# EAGLE design spi_v3 (EAGLE 7.3.0)
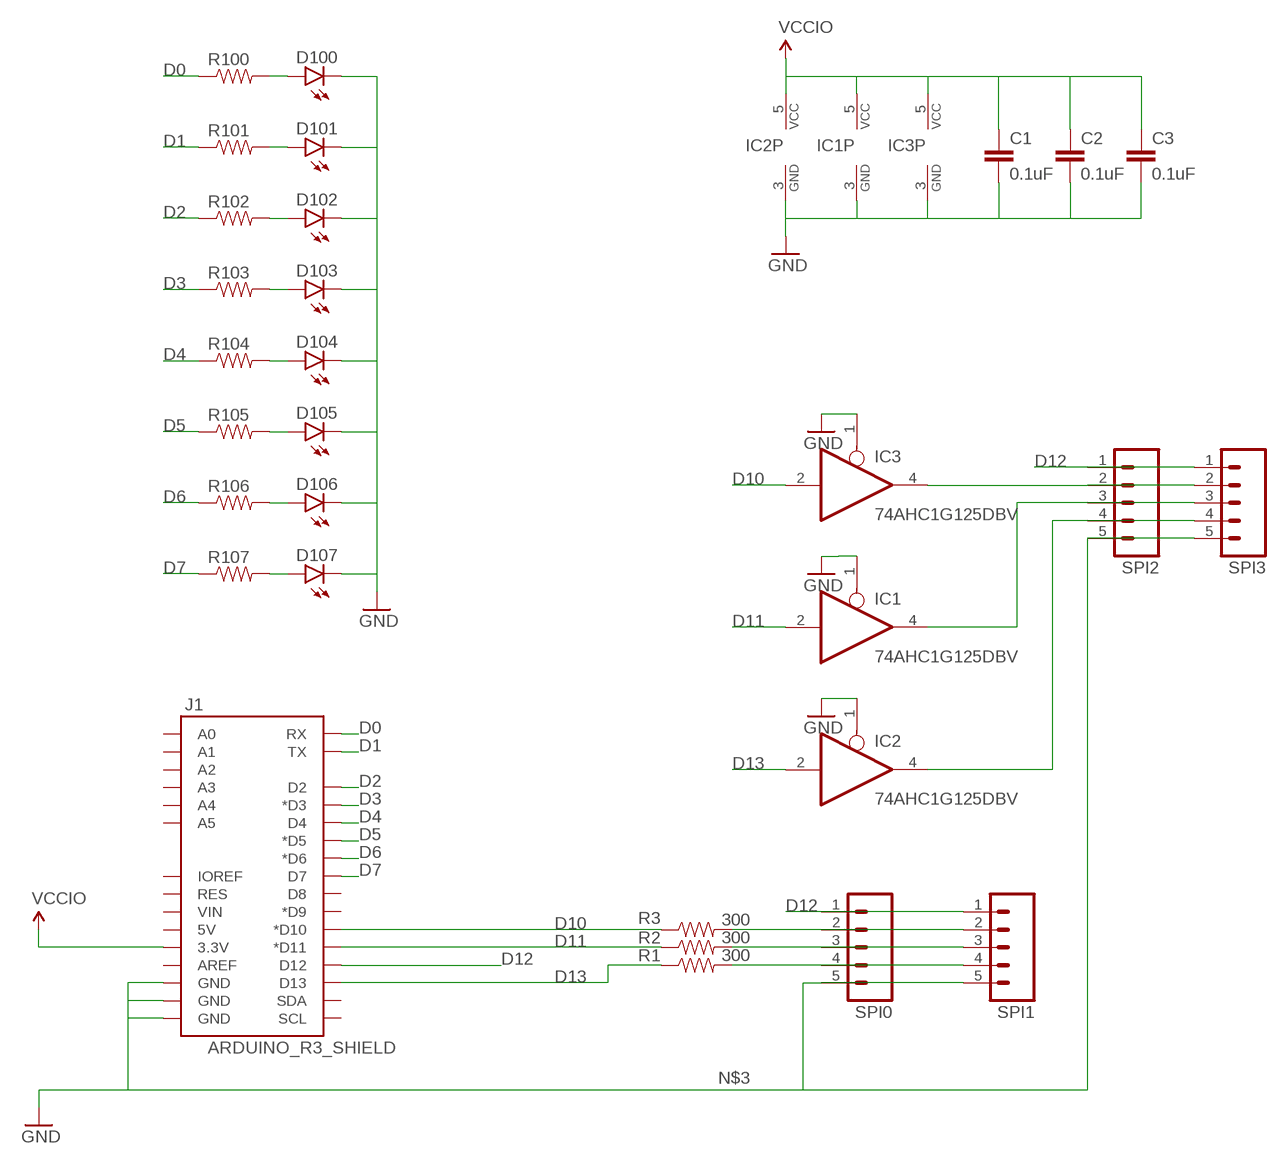
[diagram p0: schematic, sheet 1]

## Parts
C1  0.1uF  0.1UF-16V(+-10%)(0402)  [0402-CAP]
C2  0.1uF  0.1UF-16V(+-10%)(0402)  [0402-CAP]
C3  0.1uF  0.1UF-16V(+-10%)(0402)  [0402-CAP]
D100  LED-FKIT-1206  [FKIT-LED-1206]
D101  LED-FKIT-1206  [FKIT-LED-1206]
D102  LED-FKIT-1206  [FKIT-LED-1206]
D103  LED-FKIT-1206  [FKIT-LED-1206]
D104  LED-FKIT-1206  [FKIT-LED-1206]
D105  LED-FKIT-1206  [FKIT-LED-1206]
D106  LED-FKIT-1206  [FKIT-LED-1206]
D107  LED-FKIT-1206  [FKIT-LED-1206]
IC1  74AHC1G125DBV  [SOT23-5]
IC2  74AHC1G125DBV  [SOT23-5]
IC3  74AHC1G125DBV  [SOT23-5]
J1  ARDUINO_R3_SHIELD  [UNO_R3_SHIELD]
R1  300  RESISTORPTH-1/4W  [AXIAL-0.4]
R2  300  RESISTORPTH-1/4W  [AXIAL-0.4]
R3  300  RESISTORPTH-1/4W  [AXIAL-0.4]
R100  RESISTOR0805-RES  [0805]
R101  RESISTOR0805-RES  [0805]
R102  RESISTOR0805-RES  [0805]
R103  RESISTOR0805-RES  [0805]
R104  RESISTOR0805-RES  [0805]
R105  RESISTOR0805-RES  [0805]
R106  RESISTOR0805-RES  [0805]
R107  RESISTOR0805-RES  [0805]
SPI0  M05PTH_LONGPADS  [1X05_LONGPADS]
SPI1  M05PTH_LONGPADS  [1X05_LONGPADS]
SPI2  M05PTH_LONGPADS  [1X05_LONGPADS]
SPI3  M05PTH_LONGPADS  [1X05_LONGPADS]

## Nets
D0: J1.RX R100.1
D1: J1.TX R101.1
D2: J1.D2 R102.1
D3: J1.D3(*D3) R103.1
D4: J1.D4 R104.1
D5: J1.D5(*D5) R105.1
D6: J1.D6(*D6) R106.1
D7: J1.D7 R107.1
D10: IC3.2(I) J1.D10(*D10) R3.P$1
D11: IC1.2(I) J1.D11(*D11) R2.P$1
D12: J1.D12 SPI0.1 SPI1.1 SPI2.1 SPI3.1
D13: IC2.2(I) J1.D13 R1.P$1
N$1: D107.A R107.2
N$3: C1.2 C2.2 C3.2 D100.C D101.C D102.C D103.C D104.C D105.C D106.C D107.C IC1.1(OE) IC1.3(GND) IC2.1(OE) IC2.3(GND) IC3.1(OE) IC3.3(GND) J1.GND@0(GND) J1.GND@1(GND) J1.GND@2(GND) SPI0.5 SPI1.5 SPI2.5 SPI3.5 ; supply symbol labelled GND
N$4: R1.P$2 SPI0.4 SPI1.4
N$5: R2.P$2 SPI0.3 SPI1.3
N$6: R3.P$2 SPI0.2 SPI1.2
N$8: D106.A R106.2
N$9: D105.A R105.2
N$10: D104.A R104.2
N$11: D103.A R103.2
N$12: D102.A R102.2
N$13: D100.A R100.2
N$14: D101.A R101.2
N$24: IC3.4(O) SPI2.2 SPI3.2
N$25: IC1.4(O) SPI2.3 SPI3.3
N$26: IC2.4(O) SPI2.4 SPI3.4
VCCIO: C1.1 C2.1 C3.1 IC1.5(VCC) IC2.5(VCC) IC3.5(VCC) J1.3.3V
Unconnected: J1.5V J1.A0 J1.A1 J1.A2 J1.A3 J1.A4 J1.A5 J1.AREF J1.D8 J1.D9(*D9) J1.IOREF J1.RES J1.SCL J1.SDA J1.VIN

## Library data of the parts
C1-C3 = SparkFun-Capacitors:0.1UF-16V(+-10%)(0402); PROD_ID: CAP-12416
D100-D107 = SparkFun-LED:LED: LEDs Standard schematic elements and footprints for 5mm, 3mm, 1206, and 0603 sized LEDs. 5mm - Spark Fun Electronics SKU : COM-00529 (and others)
IC1-IC3 = 74xx-little-us:74*1G125: Single Bus Buffer Gate with 3-State Output
J1 = SparkFun-Boards:ARDUINO_R3_SHIELD: Shield form compatible with the Arduino Uno R3.
R1-R3 R100-R107 = SparkFun-Passives:RESISTOR: Resistor Basic schematic elements and footprints for 0603, 1206, and PTH resistors.
SPI0 SPI1-SPI3 = SparkFun-Connectors:M05: Header 5 Standard 5-pin 0.1" header. Use with straight break away headers (SKU : PRT-00116), right angle break away headers (PRT-00553), swiss pins (PRT-00743), machine pins (PRT-00117), and female headers (PRT-00115). Molex polarized connector foot print use with SKU : PRT-08230 with associated crimp pins and housings.

## Board
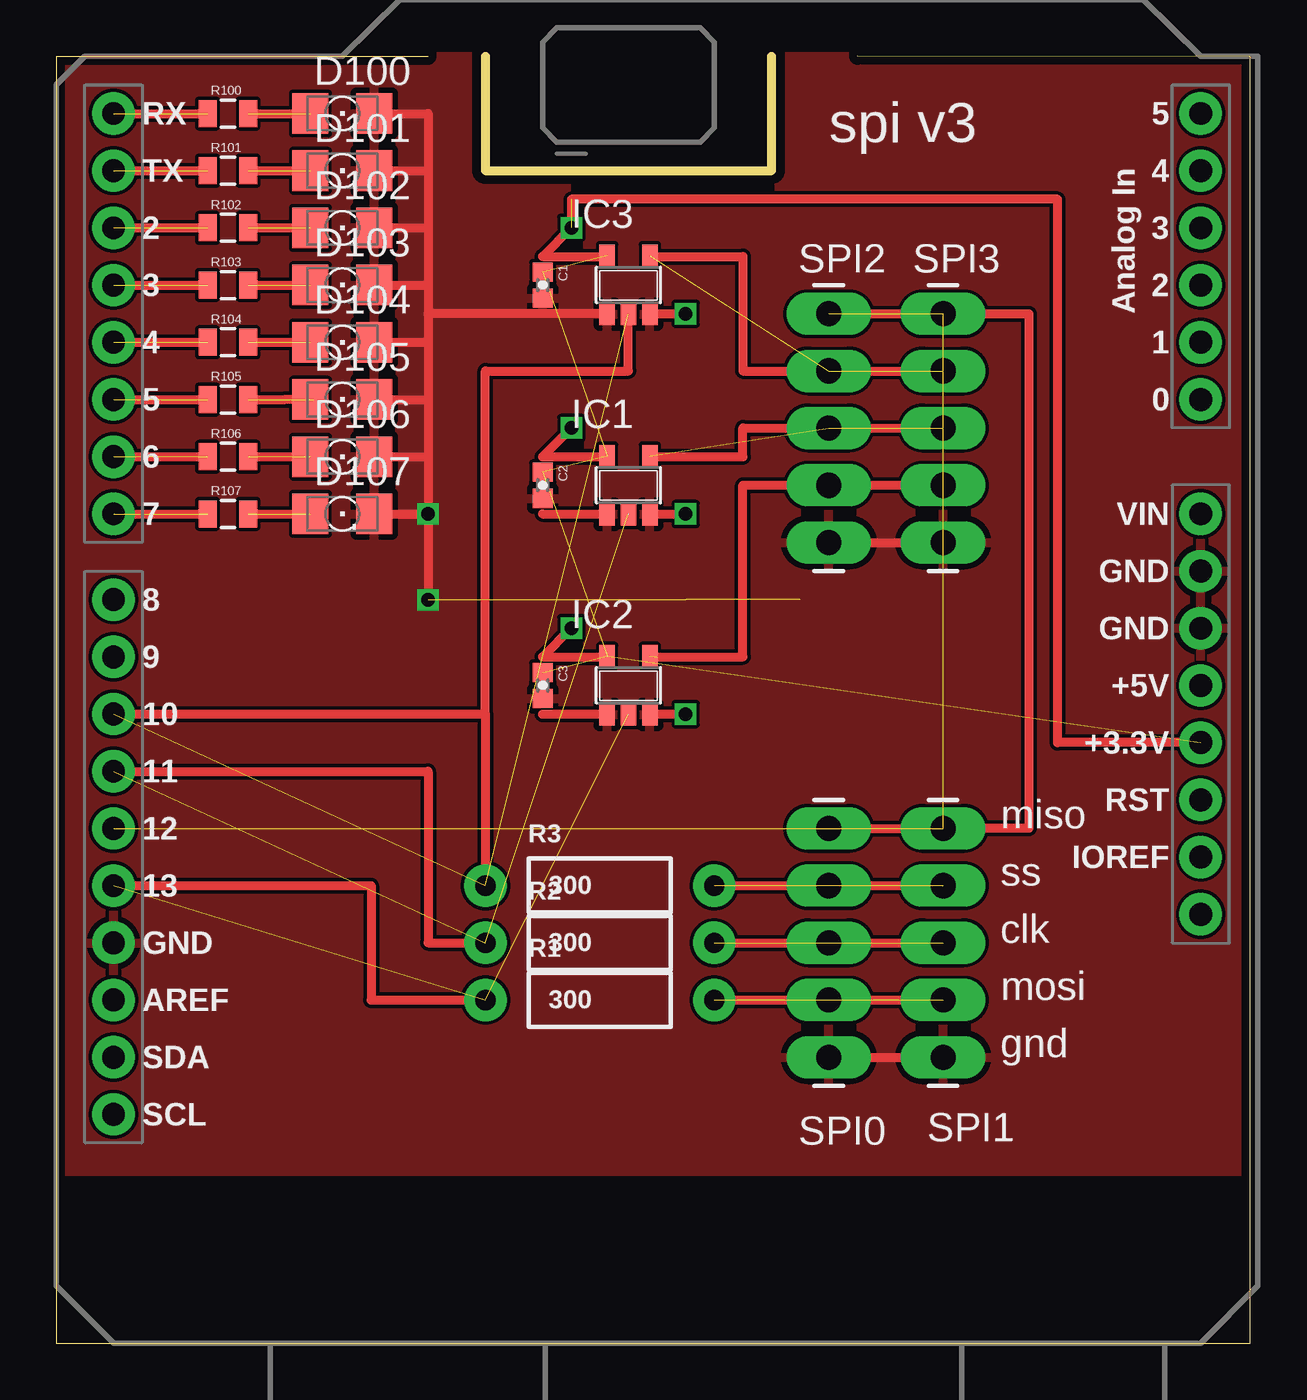
[diagram p1: board, top side]
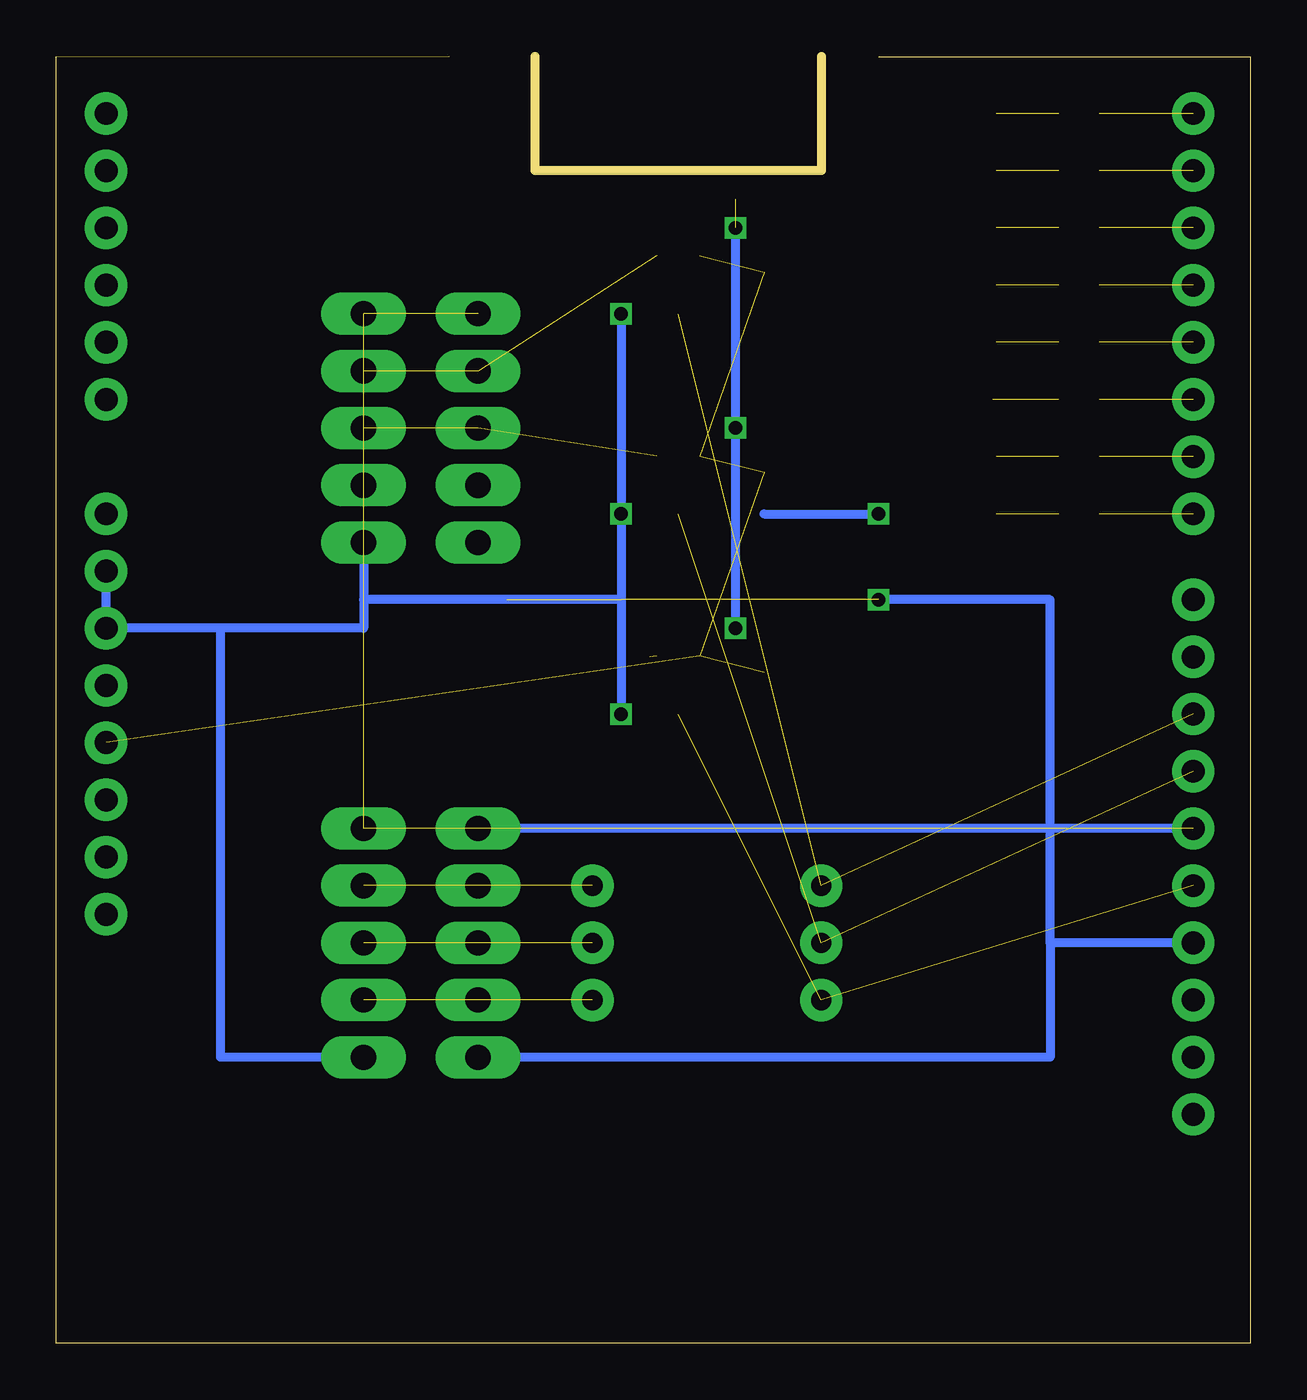
[diagram p2: board, bottom side, seen from below]

Size 53.01 x 57.15 mm. Coordinates in mm from the lower left corner, seen from the top.
Outline: 35.56,57.15 53.01,57.14 53.01,0 0,0 0,57.14 16.51,57.14
Outline: 19.05,57.15 19.05,52.07 31.75,52.07 31.75,57.15
Copper layers (1*16): Top 0.0356mm / dielectric 1.5011mm / Bottom 0.0356mm
Design rules "oshpark-2layer": minimum track width 6mil, minimum drill 13mil, track to track 6mil, track to pad 6mil, pad to pad 6mil, via to via 6mil, smd to smd 6mil, copper to edge 15mil, drill to drill 6mil, minimum pad ring 7mil, minimum via ring 7mil, stop-mask expansion 4mil, vias tented up to drill 0mil, thermal gap 10mil

### Footprints (pad centres in the part's own frame; a part is rotated, then mirrored left to right if it is on the bottom)
0402-CAP = smd 0.85 x 0.9: 1 -0.58,0; 2 0.58,0
FKIT-LED-1206 = smd 1.6 x 1.803: A -1.422,0; C 1.422,0
SOT23-5 = smd 0.69 x 0.99: 1 -0.95,-1.29; 2 0,-1.29; 3 0.95,-1.29; 4 0.95,1.3; 5 -0.95,1.3
UNO_R3_SHIELD = drill 1.016 pad 1.88: 3.3V 50.8,26.67; 5V 50.8,29.21; A0 50.8,41.91; A1 50.8,44.45; A2 50.8,46.99; A3 50.8,49.53; A4 50.8,52.07; A5 50.8,54.61; AREF 2.54,15.24; D2 2.54,49.53; D3 2.54,46.99; D4 2.54,44.45; D5 2.54,41.91; D6 2.54,39.37; D7 2.54,36.83; D8 2.54,33.02; D9 2.54,30.48; D10 2.54,27.94; D11 2.54,25.4; D12 2.54,22.86; D13 2.54,20.32; GND@0 50.8,31.75; GND@1 50.8,34.29; GND@2 2.54,17.78; IOREF 50.8,21.59; NC 50.8,19.05; RES 50.8,24.13; RX 2.54,54.61; SCL 2.54,10.16; SDA 2.54,12.7; TX 2.54,52.07; VIN 50.8,36.83
AXIAL-0.4 = drill 0.9 pad 1.88: P$1 -5.08,0; P$2 5.08,0
0805 = smd 0.8 x 1.2: 1 -0.9,0; 2 0.9,0
1X05_LONGPADS = drill 1.118 pad 1.88 long: 1 0,0; 2 2.54,0; 3 5.08,0; 4 7.62,0; 5 10.16,0

### Placement (x,y rotation side)
C1  21.59,46.99 270 top
C2  21.59,38.1 270 top
C3  21.59,29.21 270 top
D100  12.7,54.61 0 top
D101  12.7,52.07 0 top
D102  12.7,49.53 0 top
D103  12.7,46.99 0 top
D104  12.7,44.45 0 top
D105  12.7,41.91 0 top
D106  12.7,39.37 0 top
D107  12.7,36.83 0 top
IC1  25.4,38.1 0 top
IC2  25.4,29.21 0 top
IC3  25.4,46.99 0 top
J1  0,0 0 top
R1  24.13,15.24 0 top
R2  24.13,17.78 0 top
R3  24.13,20.32 0 top
R100  7.62,54.61 0 top
R101  7.62,52.07 0 top
R102  7.62,49.53 0 top
R103  7.62,46.99 0 top
R104  7.62,44.45 0 top
R105  7.62,41.91 0 top
R106  7.62,39.37 0 top
R107  7.62,36.83 0 top
SPI0  34.29,22.86 270 top
SPI1  39.37,22.86 270 top
SPI2  34.29,45.72 270 top
SPI3  39.37,45.72 270 top

### Tracks (layer width: path | path; a pad name or v marks a point on that pad's centre or on a via)
D0  (1 unrouted)
  Top 0.406: J1.RX 6.35,54.61
D1  (1 unrouted)
  Top 0.406: J1.TX 6.35,52.07
D2  (1 unrouted)
  Top 0.406: J1.D2 6.35,49.53
D3  (1 unrouted)
  Top 0.406: J1.D3 6.35,46.99
D4  (1 unrouted)
  Top 0.406: J1.D4 6.35,44.45
D5  (1 unrouted)
  Top 0.406: J1.D5 6.35,41.91
D6  (1 unrouted)
  Top 0.406: J1.D6 6.35,39.37
D7  (1 unrouted)
  Top 0.406: J1.D7 6.35,36.83
D10  (2 unrouted)
  Top 0.406: J1.D10 19.05,27.94 | 19.05,27.94 R3.P$1 | 19.05,27.94 19.05,43.18 25.4,43.18 25.4,45.72
D11  (2 unrouted)
  Top 0.406: J1.D11 16.51,25.4 16.51,17.78 R2.P$1
D12  (5 unrouted)
  Top 0.406: SPI0.1 SPI1.1 43.18,22.86 43.18,45.72 SPI3.1 SPI2.1
  Bottom 0.406: J1.D12 SPI0.1
D13  (2 unrouted)
  Top 0.406: J1.D13 13.97,20.32 13.97,15.24 R1.P$1
N$1  (1 unrouted)
N$3  (via drill 0.6)  (4 unrouted)
  Top 0.406: SPI2.5 SPI3.5 | SPI0.5 SPI1.5 | 13.97,54.61 16.51,54.61 16.51,52.07 | 16.51,52.07 16.51,49.53 | 16.51,49.53 16.51,46.99 | 16.51,46.99 16.51,45.72 | 16.51,45.72 16.51,44.45 | 16.51,44.45 16.51,41.91 | 16.51,41.91 16.51,39.37 | 16.51,39.37 v16.51,36.83 | v16.51,36.83 v16.51,33.02 | 13.97,36.83 v16.51,36.83 | 13.97,39.37 16.51,39.37 | 13.97,41.91 16.51,41.91 | 13.97,44.45 16.51,44.45 | 13.97,46.99 16.51,46.99 | 13.97,49.53 16.51,49.53 | 13.97,52.07 16.51,52.07 | 24.13,45.72 16.51,45.72
  Bottom 0.406: SPI3.5 39.37,33.02 | 39.37,33.02 39.37,31.75 45.72,31.75 | 45.72,31.75 J1.GND@0 J1.GND@1 | J1.GND@2 8.89,17.78 | 8.89,17.78 8.89,12.7 SPI0.5 | 8.89,17.78 8.89,33.02 v16.51,33.02 | 27.94,33.02 39.37,33.02 | 21.59,36.83 v16.51,36.83 | SPI1.5 45.72,12.7 45.72,31.75
  pour Top: 0,57.15 53.34,57.15 53.34,7.62 0,7.62
N$4  (2 unrouted)
  Top 0.406: R1.P$2 SPI0.4 SPI1.4
N$5  (2 unrouted)
  Top 0.406: R2.P$2 SPI0.3 SPI1.3
N$6  (2 unrouted)
  Top 0.406: R3.P$2 SPI0.2 SPI1.2
N$7
  Top 0.406: 11.43,41.91 10.16,41.91 8.89,41.91
N$8  (1 unrouted)
N$9  (1 unrouted)
N$10  (1 unrouted)
N$11  (1 unrouted)
N$12  (1 unrouted)
N$13  (1 unrouted)
N$14  (1 unrouted)
N$15
  Top 0.406: 8.89,54.61 11.43,54.61
N$16
  Top 0.406: 8.89,52.07 11.43,52.07
N$17
  Top 0.406: 8.89,49.53 11.43,49.53
N$18
  Top 0.406: 8.89,46.99 11.43,46.99
N$20
  Top 0.406: 8.89,44.45 11.43,44.45
N$21  (1 unrouted)
N$22
  Top 0.406: 8.89,39.37 11.43,39.37
N$23
  Top 0.406: 8.89,36.83 11.43,36.83
N$24  (2 unrouted)
  Top 0.406: 26.67,48.26 30.48,48.26 30.48,43.18 SPI2.2 SPI3.2
N$25  (2 unrouted)
  Top 0.406: 26.67,39.37 30.48,39.37 30.48,40.64 SPI2.3 SPI3.3
N$26  (1 unrouted)
  Top 0.406: 26.67,30.48 30.48,30.48 30.48,38.1 SPI2.4 SPI3.4
N$27
  Top 0.406: 21.59,36.83 24.13,36.83
N$29
  Top 0.406: 21.59,27.94 24.13,27.94
N$31  (via drill 0.6)
  Top 0.406: 26.67,45.72 v27.94,45.72 | 26.67,27.94 v27.94,27.94
  Bottom 0.406: v27.94,45.72 v27.94,27.94
N$32  (via drill 0.6)
  Top 0.406: 26.67,36.83 v27.94,36.83
VCCIO  (via drill 0.6)  (7 unrouted)
  Top 0.406: J1.3.3V 44.45,26.67 44.45,50.8 22.86,50.8 v22.86,49.53 21.59,48.26 24.13,48.26 | 24.13,39.37 21.59,39.37 v22.86,40.64 | 24.13,30.48 21.59,30.48 v22.86,31.75
  Bottom 0.406: v22.86,49.53 v22.86,40.64 v22.86,31.75

### Text on the board
tPlace: spi v3
tNames: miso | ss | clk | mosi | gnd